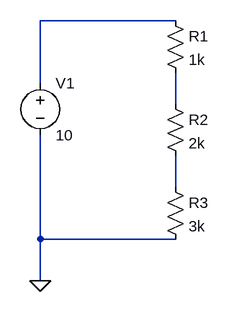
[diagram p0: schematic circuit.asc]
circuit.asc, the LTspice schematic file:
Version 4
SHEET 1 880 680
WIRE 256 32 48 32
WIRE 48 128 48 32
WIRE 256 160 256 112
WIRE 256 288 256 240
WIRE 48 368 48 208
WIRE 256 368 48 368
WIRE 48 432 48 368
FLAG 48 432 0
SYMBOL voltage 48 112 R0
WINDOW 123 0 0 Left 0
WINDOW 39 0 0 Left 0
SYMATTR InstName V1
SYMATTR Value 10
SYMBOL res 240 16 R0
SYMATTR InstName R1
SYMATTR Value 1k
SYMBOL res 240 144 R0
SYMATTR InstName R2
SYMATTR Value 2k
SYMBOL res 240 272 R0
SYMATTR InstName R3
SYMATTR Value 3k

The netlist it stands for:
* circuit.asc
V1 N001 0 10
R1 N001 N002 1k
R2 N002 N003 2k
R3 N003 0 3k
.backanno
.end